# EasyEDA schematic block detector schematic.json
TITLE: Sheet_1; REV: 1.0; Date: 2020-02-03; Sheet: 1/1; Drawn By: jwkelly49; Company: Your Company
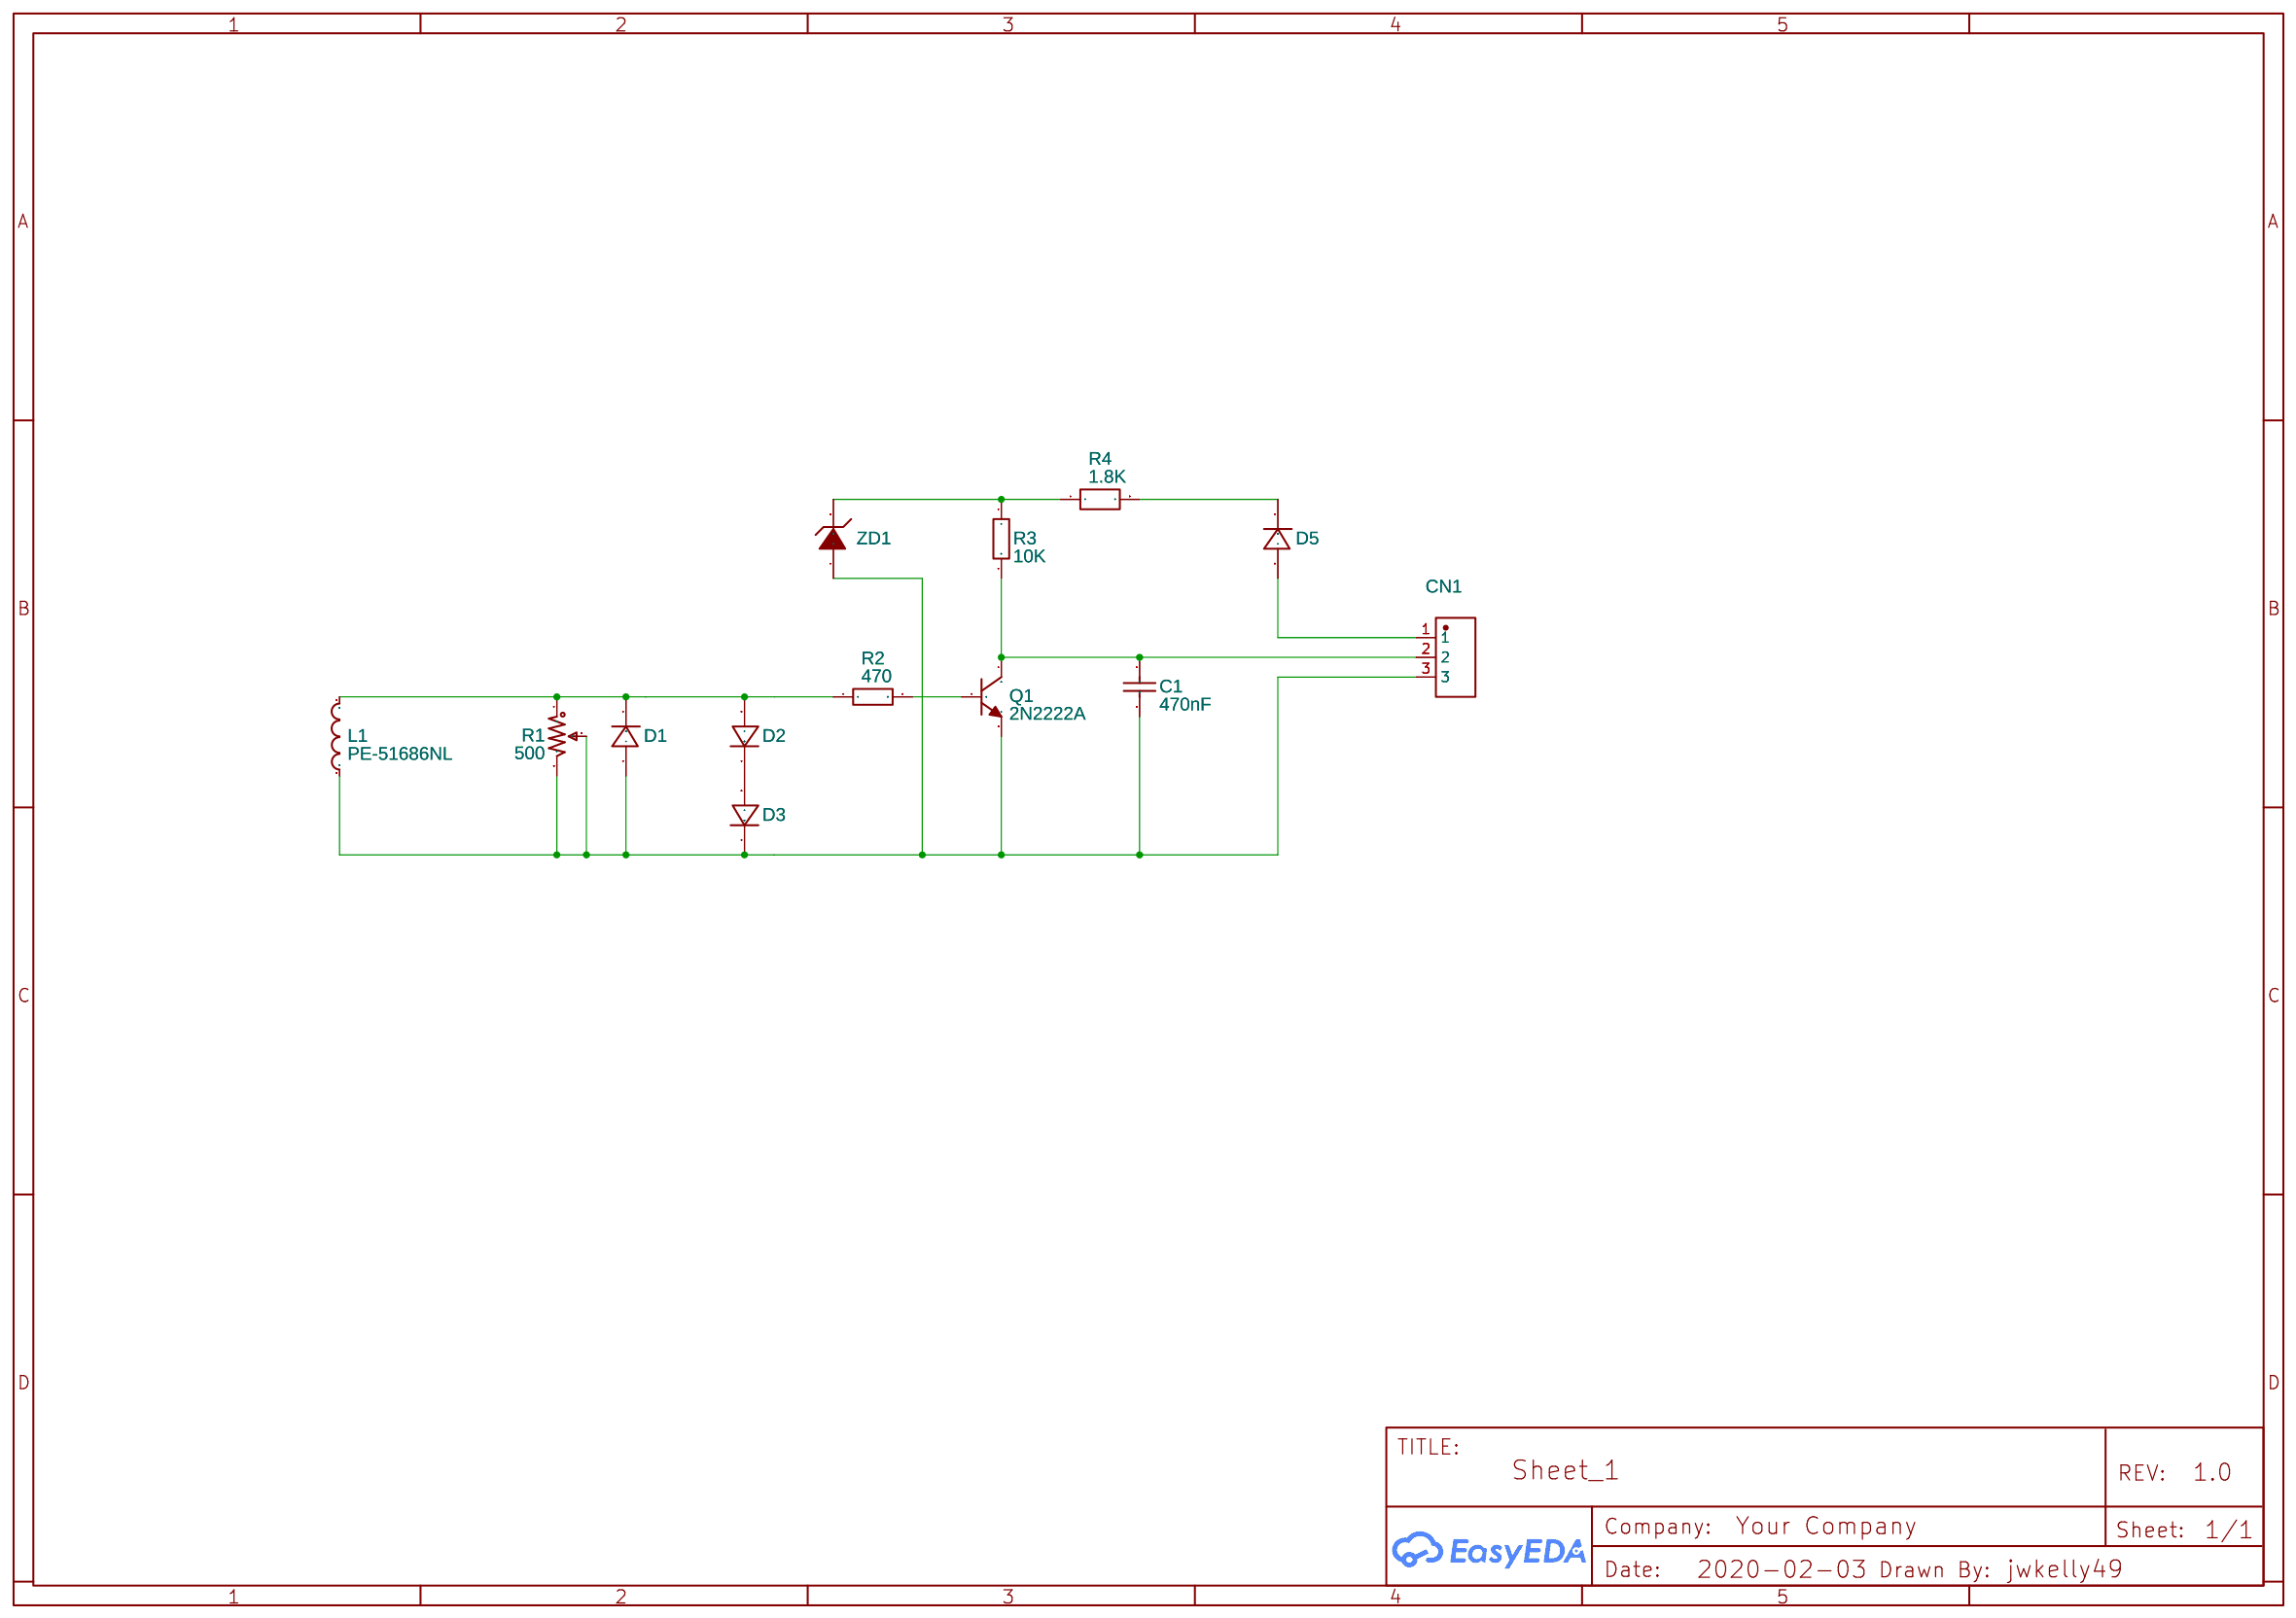
[diagram p0: schematic sheet]

## Parts
C1  470nF  [CAP-TH_L8.5-W5.0-P5.00-D1.2]
CN1  WJ25C-B-7.62-3P-13-00A  [CONN-TH_3P-P7.62_WJ25C-B-7.62-3P]
D1  1N4001_C331627  [DO-41_BD2.4-L4.7-P8.70-D0.9-RD]
D2  1N4001_C331627  [DO-41_BD2.4-L4.7-P8.70-D0.9-RD]
D3  1N4001_C331627  [DO-41_BD2.4-L4.7-P8.70-D0.9-RD]
D5  1N4001_C331627  [DO-41_BD2.4-L4.7-P8.70-D0.9-RD]
L1  PE-51686NL  [ZMCT102]
Q1  2N2222A  [TO-92-3_L4.8-W3.7-P2.54-R]
R1  500  [RES-ADJ-TH_3362S]
R2  470  [RES-TH_BD2.2-L6.5-P10.50-D0.6]
R3  10K  [AXIAL-0.4]
R4  1.8K  [RES-TH_BD2.4-L6.3-P10.30-D0.6]
ZD1  1N4734A_C41430  [DO-41_BD2.8-L4.2-P8.00-D0.7-FD]

## Library data of the parts
C1 = CT4-0805B474K500F3: Supplier: LCSC; Manufacturer: FH; Contributor: LCSC; Supplier Part: C93116
CN1 = WJ25C-B-7.62-3P-13-00A: Supplier: LCSC; Manufacturer: ReliaPro; image: //image.lceda.cn/szlcsc/C61583.jpg; Supplier Part: C61583
D1-D3 D5 = 1N4001_C331627: Supplier: LCSC; Supplier Part: C331627; Manufacturer: GW; Manufacturer Part: 1N4001; Contributor: LCSC
L1 = ZMCT102: Supplier: LCSC; Manufacturer: ZEMING; Supplier Part: C84213
Q1 = 2N2222A: Supplier: LCSC; Supplier Part: C358533; Manufacturer: Foshan Blue Rocket Elec; Contributor: LCSC
R1 = 3362S-1-501LF: Supplier: LCSC; Manufacturer: BOURNS; Supplier Part: C81261
R2 = CF1/4W-470Ω±5% T52: Supplier: LCSC; Supplier Part: C120047; Manufacturer: Chian Chia Elec; Contributor: LCSC
R3 = CFR0W4J0103A50: Supplier: LCSC; Manufacturer: UniOhm; Supplier Part: C61299
R4 = RD 1/4W 1K8 J T/B A1: Supplier: LCSC; Supplier Part: C433758; Manufacturer: TyoHM; Contributor: LCSC
ZD1 = 1N4734A_C41430: Supplier: LCSC; Manufacturer Part: 1N4734A; Manufacturer: SEMTECH; image: //image.lceda.cn/szlcsc/C41430.jpg; Supplier Part: C41430

## Nets
Net-(C1-1): C1.1 CN1.2 Q1.1(C) R3.2
Net-(C1-2): C1.2 CN1.3 D1.2(A) D3.1(C) L1.1 Q1.3(E) R1.2 R1.3 ZD1.1(A)
Net-(CN1-1): CN1.1 D5.2(A)
Net-(D1-1): D1.1(C) D2.2(A) L1.2 R1.1 R2.1
Net-(D2-1): D2.1(C) D3.2(A)
Net-(D5-1): D5.1(C) R4.2
Net-(Q1-2): Q1.2(B) R2.2
Net-(R3-1): R3.1 R4.1 ZD1.2(K)
